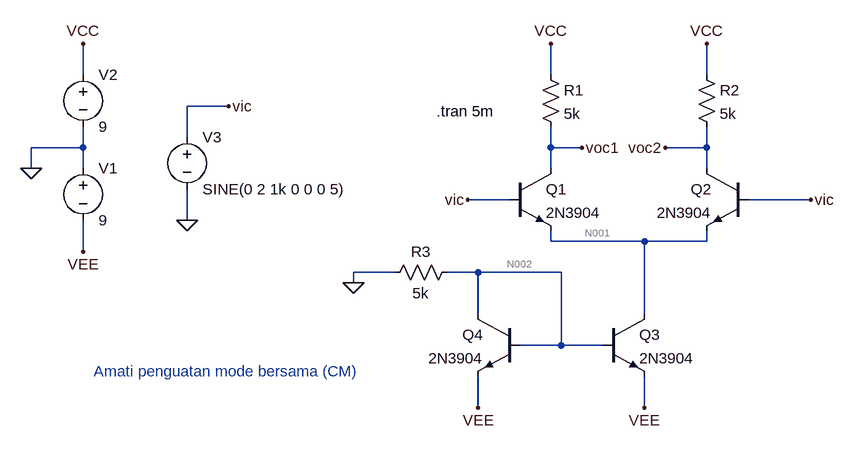
[diagram p0: schematic Perc-01-04-commonmode.asc]
Perc-01-04-commonmode.asc, the LTspice schematic file:
Version 4
SHEET 1 880 680
WIRE -320 -32 -320 -80
WIRE 400 -32 400 -80
WIRE 640 -32 640 -80
WIRE -96 16 -160 16
WIRE -160 64 -160 16
WIRE -320 80 -320 48
WIRE -320 80 -400 80
WIRE 400 80 400 48
WIRE 448 80 400 80
WIRE 640 80 640 48
WIRE 640 80 576 80
WIRE -400 112 -400 80
WIRE -320 112 -320 80
WIRE 400 112 400 80
WIRE 640 112 640 80
WIRE 336 160 272 160
WIRE 800 160 704 160
WIRE -160 192 -160 144
WIRE 400 224 400 208
WIRE 544 224 400 224
WIRE 640 224 640 208
WIRE 640 224 544 224
WIRE -320 240 -320 192
WIRE 160 272 96 272
WIRE 288 272 240 272
WIRE 416 272 288 272
WIRE 96 288 96 272
WIRE 288 336 288 272
WIRE 544 336 544 224
WIRE 416 384 416 272
WIRE 416 384 352 384
WIRE 480 384 416 384
WIRE 288 480 288 432
WIRE 544 480 544 432
FLAG 400 -80 VCC
FLAG 640 -80 VCC
FLAG 272 160 vic
FLAG 448 80 voc1
FLAG 576 80 voc2
FLAG -320 -80 VCC
FLAG -320 240 VEE
FLAG -400 112 0
FLAG -160 192 0
FLAG -96 16 vic
FLAG 96 288 0
FLAG 288 480 VEE
FLAG 544 480 VEE
FLAG 800 160 vic
SYMBOL npn 336 112 R0
SYMATTR InstName Q1
SYMATTR Value 2N3904
SYMBOL npn 704 112 M0
SYMATTR InstName Q2
SYMATTR Value 2N3904
SYMBOL res 384 -48 R0
SYMATTR InstName R1
SYMATTR Value 5k
SYMBOL res 624 -48 R0
SYMATTR InstName R2
SYMATTR Value 5k
SYMBOL voltage -320 96 R0
WINDOW 123 0 0 Left 0
WINDOW 39 0 0 Left 0
SYMATTR InstName V1
SYMATTR Value 9
SYMBOL voltage -320 -48 R0
WINDOW 123 0 0 Left 0
WINDOW 39 0 0 Left 0
SYMATTR InstName V2
SYMATTR Value 9
SYMBOL voltage -160 48 R0
WINDOW 123 0 0 Left 0
WINDOW 39 0 0 Left 0
SYMATTR InstName V3
SYMATTR Value SINE(0 2 1k 0 0 0 5)
SYMBOL npn 480 336 R0
SYMATTR InstName Q3
SYMATTR Value 2N3904
SYMBOL npn 352 336 M0
SYMATTR InstName Q4
SYMATTR Value 2N3904
SYMBOL res 256 256 R90
WINDOW 0 0 56 VBottom 2
WINDOW 3 32 56 VTop 2
SYMATTR InstName R3
SYMATTR Value 5k
TEXT 224 24 Left 2 !.tran 5m
TEXT -304 424 Left 2 ;Amati penguatan mode bersama (CM)

The netlist it stands for:
* Perc-01-04-commonmode.asc
Q1 voc1 vic N001 0 2N3904
Q2 voc2 vic N001 0 2N3904
R1 VCC voc1 5k
R2 VCC voc2 5k
V1 0 VEE 9
V2 VCC 0 9
V3 vic 0 SINE(0 2 1k 0 0 0 5)
Q3 N001 N002 VEE 0 2N3904
Q4 N002 N002 VEE 0 2N3904
R3 N002 0 5k
.model NPN NPN
.model PNP PNP
.lib standard.bjt
.tran 5m
* Amati penguatan mode bersama (CM)
.backanno
.end

* Results of the author's LTspice run, read from the files saved beside the schematic
* Operating Point, zero values left out:
*   V(voc1) = 4.56 V
*   V(n001) = -651.1 mV
*   V(voc2) = 4.56 V
*   V(vcc) = 9 V
*   V(vee) = -9 V
*   V(n002) = -8.331 V
*   Ic(Q4) = 1.655 mA
*   Ib(Q4) = 5.54 µA
*   Ie(Q4) = -1.661 mA
*   Ic(Q3) = 1.781 mA
*   Ib(Q3) = 5.538 µA
*   Ie(Q3) = -1.787 mA
*   Ic(Q2) = 887.9 µA
*   Ib(Q2) = 2.837 µA
*   Ie(Q2) = -890.7 µA
*   Ic(Q1) = 887.9 µA
*   Ib(Q1) = 2.837 µA
*   Ie(Q1) = -890.7 µA
*   I(R3) = -1.666 mA
*   I(R2) = 887.9 µA
*   I(R1) = 887.9 µA
*   I(V3) = -5.673 µA
*   I(V2) = -1.776 mA
*   I(V1) = -3.448 mA
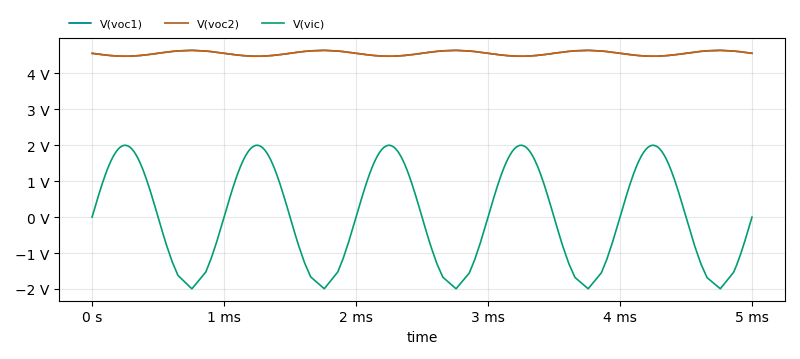
[diagram p1: Transient Analysis of Perc-01-04-commonmode.asc, plotted from the saved traces]
* Transient Analysis, 1 run:
*   V(voc1): min 4.479 V, max 4.642 V, average 4.56 V, rms 4.56 V, last 4.56 V
*   V(voc2): min 4.479 V, max 4.642 V, average 4.56 V, rms 4.56 V, last 4.56 V
*   V(vic): min -1.996 V, max 2 V, average 14.12 mV, rms 1.4 V, last 0 V